# EAGLE design ford_q3 (EAGLE 9.6.2)
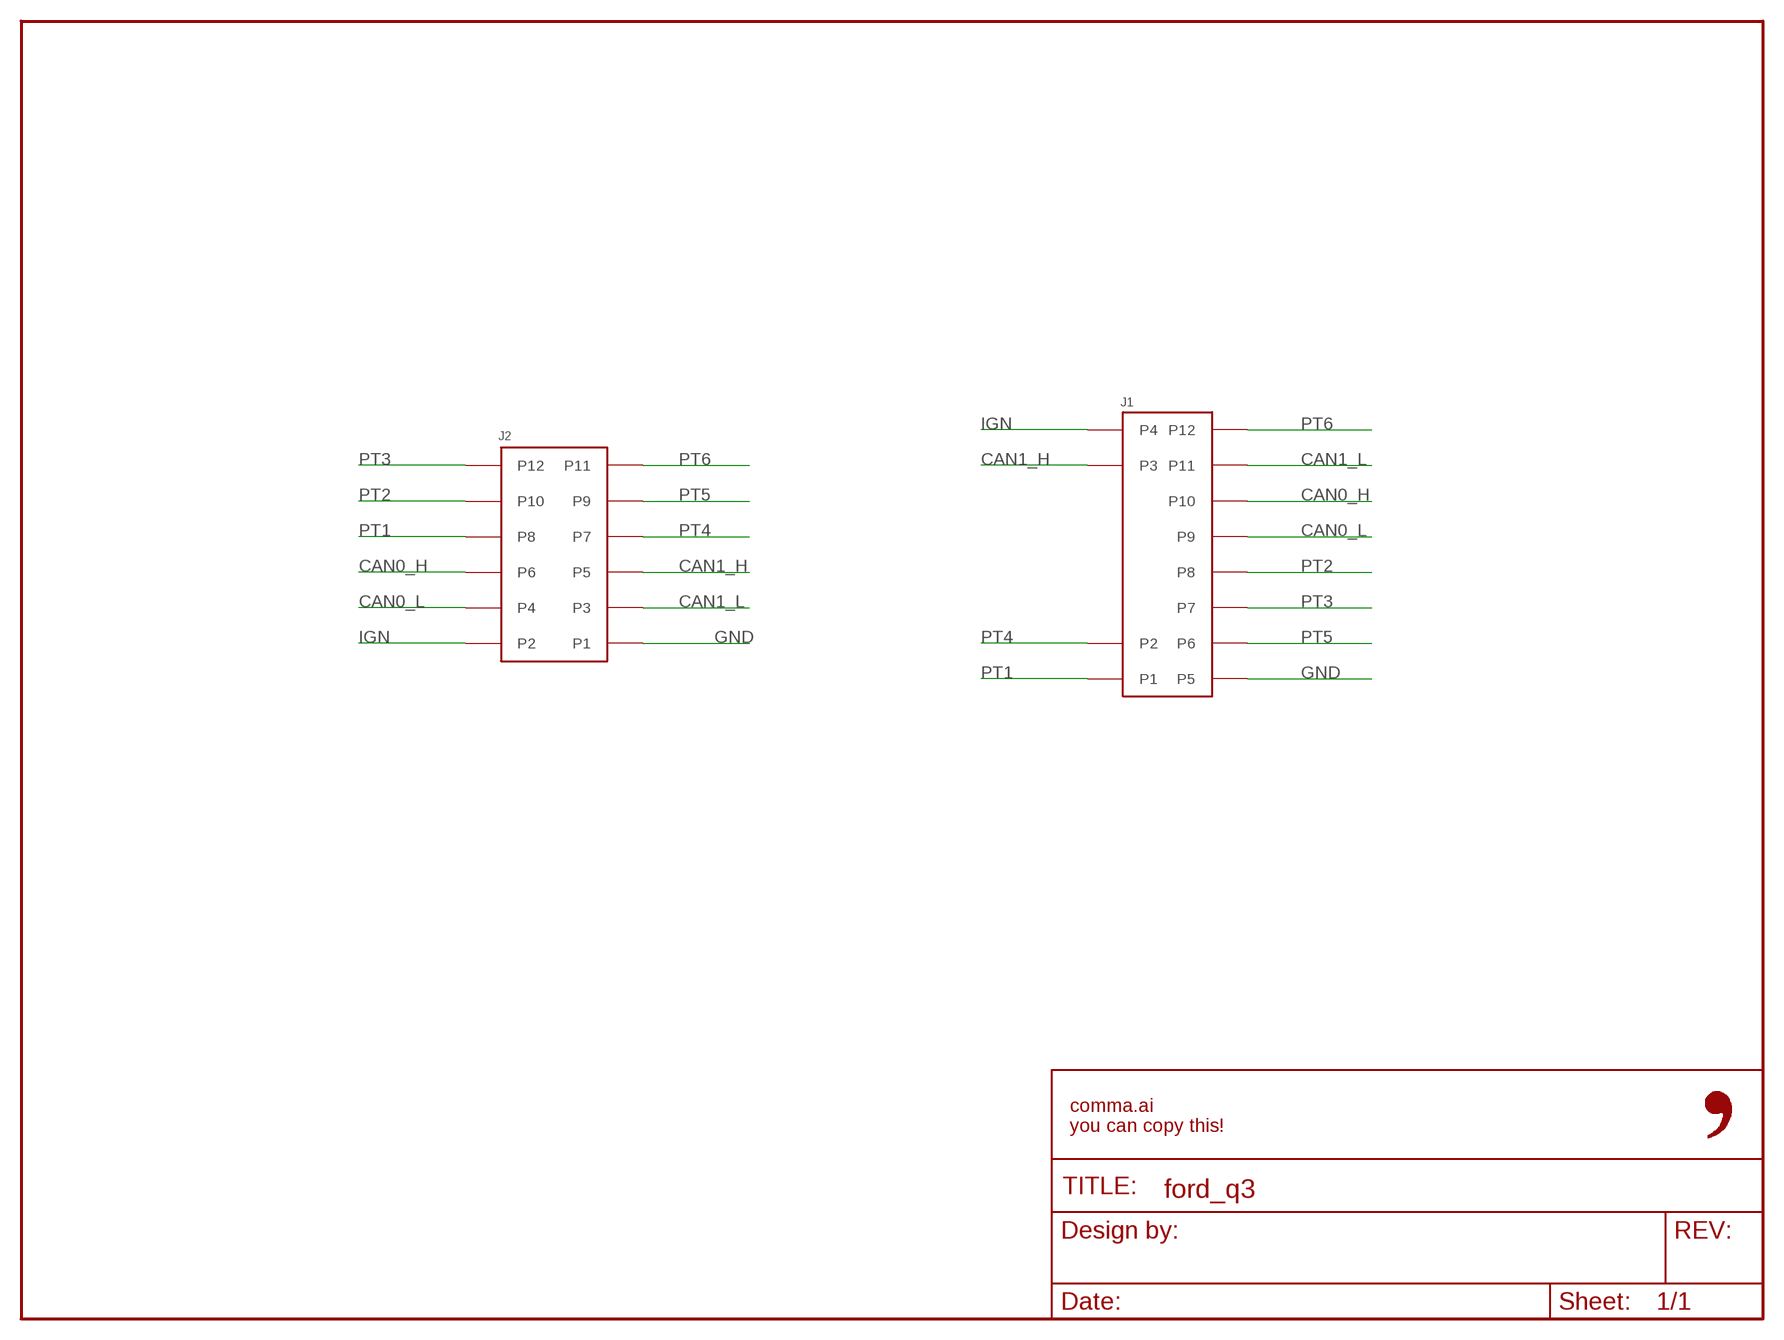
[diagram p0: schematic, sheet 1]

## Parts
FRAME1  FRAME-LETTER-OPENNO_PACKAGE  [DUMMY]
J1  0348260124  [0348260124]
J2  5018761240  [5018761240]

## Nets
CAN0_H: J1.P10 J2.P6
CAN0_L: J1.P9 J2.P4
CAN1_H: J1.P3 J2.P5
CAN1_L: J1.P11 J2.P3
GND: J1.P5 J2.P1
IGN: J1.P4 J2.P2
PT1: J1.P1 J2.P8
PT2: J1.P8 J2.P10
PT3: J1.P7 J2.P12
PT4: J1.P2 J2.P7
PT5: J1.P6 J2.P9
PT6: J1.P12 J2.P11

## Library data of the parts
FRAME1 = comma.ai:FRAME-LETTER-OPEN: Schematic Frame - Letter Standard 8.5x11 US Letter frame; DESIGNER: Nobody; VERSION: v01
J1 = 0348240124:0348260124; CPN: CAI-HARNESS-MOLEX-0348260124; MPN: 0348260124
J2 = 5018761440:5018761240; CPN: CAI-HARNESS-MOLEX-5018761240; MPN: 5018761240

## Board
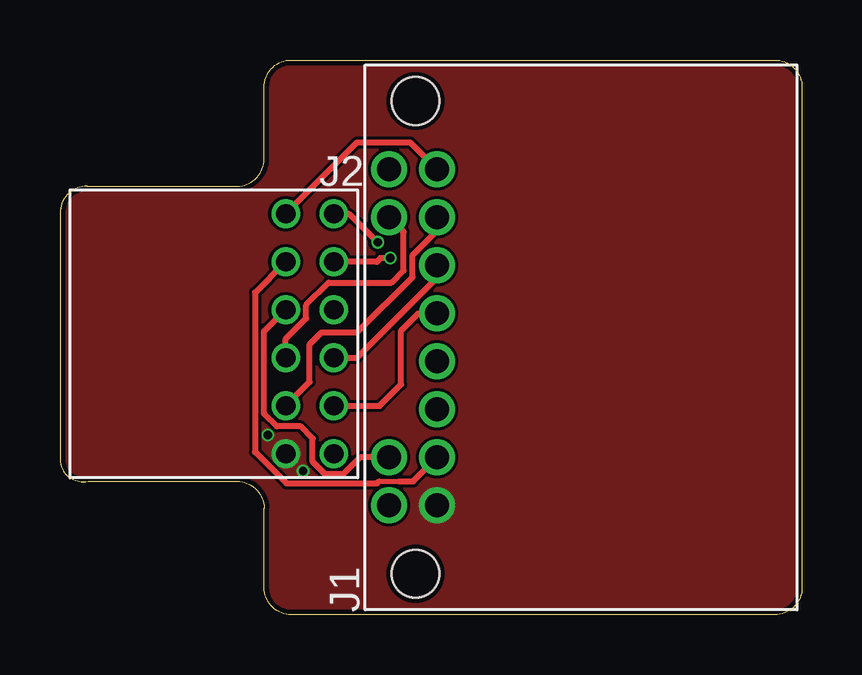
[diagram p1: board, top side]
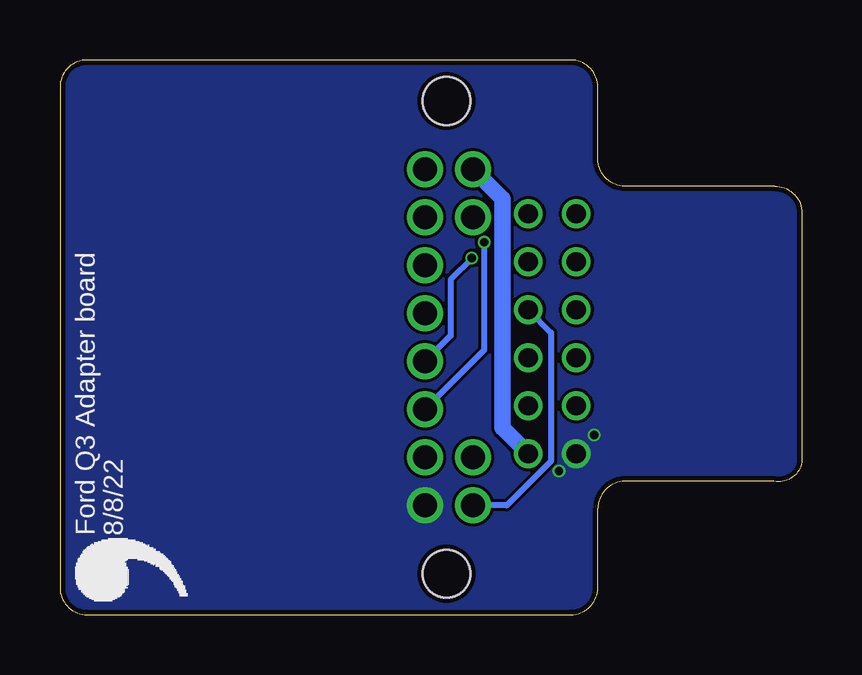
[diagram p2: board, bottom side, seen from below]

Size 30.94 x 23.11 mm. Coordinates in mm from the lower left corner, seen from the top.
Outline: 1.17,5.56 7.38,5.56 arc-90 8.51,4.43 8.51,1.13 arc90 9.64,0 29.81,0 arc90 30.94,1.13 30.94,21.98 arc90 29.81,23.11 9.64,23.11 arc90 8.51,21.98 8.51,18.99 arc-90 7.38,17.86 1.14,17.86 arc90 0,16.74 0,6.35 arc90 1.17,5.56
Copper layers (1*16): Top 0.035mm / dielectric 1.5mm / Bottom 0.035mm
Design rules "jlcpcb_2layer": minimum track width 5mil, minimum drill 12mil, track to track 5mil, track to pad 5mil, pad to pad 5mil, via to via 5mil, smd to smd 5mil, copper to edge 8mil, drill to drill 8mil, minimum pad ring 3mil, minimum via ring 3mil, stop-mask expansion 4mm, vias tented up to drill 20mil, thermal gap 10mil

### Footprints (pad centres in the part's own frame; a part is rotated, then mirrored left to right if it is on the bottom)
0348260124 = drill 1: P1 -7,2; P2 -5,2; P3 5,2; P4 7,2; P5 -7,0; P6 -5,0; P7 -3,0; P8 -1,0; P9 1,0; P10 3,0; P11 5,0; P12 7,0 | hole 2: -9.85,0.9; 9.85,0.9
5018761240 = drill 0.8: P1 5,-1; P2 5,1; P3 3,-1; P4 3,1; P5 1,-1; P6 1,1; P7 -1,-1; P8 -1,1; P9 -3,-1; P10 -3,1; P11 -5,-1; P12 -5,1

### Placement (x,y rotation side)
FRAME1  -0.61,-1.85 0 top
J1  15.72,11.56 90 top
J2  10.41,11.71 270 top
U$1  [LOGO]  25.32,-0.1 90 bottom

### Tracks (layer width: path | path; a pad name or v marks a point on that pad's centre or on a via)
CAN0_H
  Top 0.254: J2.P6 12.38,10.71 15.72,14.05 J1.P10
CAN0_L
  Top 0.254: J2.P4 13.33,8.71 14.22,9.6 14.22,11.84 14.95,12.56 J1.P9
CAN1_H
  Top 0.254: J2.P5 9.41,11.5 10.27,12.35 10.27,12.91 11.2,13.84 13.82,13.84 14.33,14.35 14.33,15.95 J1.P3
CAN1_L
  Top 0.254: J2.P3 10.41,9.71 10.41,11.28 10.9,11.76 12.39,11.76 14.71,14.07 14.71,14.99 15.72,16 J1.P11
GND  (via drill 0.35)
  other vias: 10.13,5.99 8.66,7.49
  pour Top (no thermals): -6.35,26.16 34.29,26.16 34.29,-3.05 -6.35,-3.05
  pour Bottom (no thermals): -5.08,24.89 35.56,24.89 35.56,-4.32 -5.08,-4.32
IGN
  Bottom 0.69: J1.P4 12.5,17.33 12.5,7.79 J2.P2
PT1
  Bottom 0.254: J2.P8 10.46,11.76 10.46,6.4 12.31,4.56 J1.P1
PT2  (via drill 0.35)
  Top 0.254: v13.77,14.86 13.36,14.86 13.21,14.71 J2.P10
  Bottom 0.254: v13.77,14.86 14.66,13.97 14.66,11.62 J1.P8
PT3  (via drill 0.35)
  Top 0.254: v13.24,15.52 v13.23,15.52 12.05,16.71 J2.P12
  Bottom 0.254: J1.P7 13.24,11.04 v13.24,15.52
PT4
  Top 0.254: J1.P2 12.5,6.56 11.8,5.85 11.06,5.85 10.54,6.37 10.54,7.34 10.03,7.85 9.04,7.85 8.51,8.38 8.51,11.8 J2.P7
PT5
  Top 0.203: 13.3,5.56 14.14,5.56
  Top 0.254: J1.P6 14.72,5.56 14.14,5.56 | J2.P9 8.13,13.42 8.13,6.79 9.44,5.47 13.22,5.47 13.3,5.56
PT6
  Top 0.254: J2.P11 12.39,19.69 14.6,19.69 J1.P12

### Text on the board
bNames: 8/8/22 | Ford Q3 Adapter board